# EAGLE design S-270_Malus_Main_board (EAGLE 9.5.1)
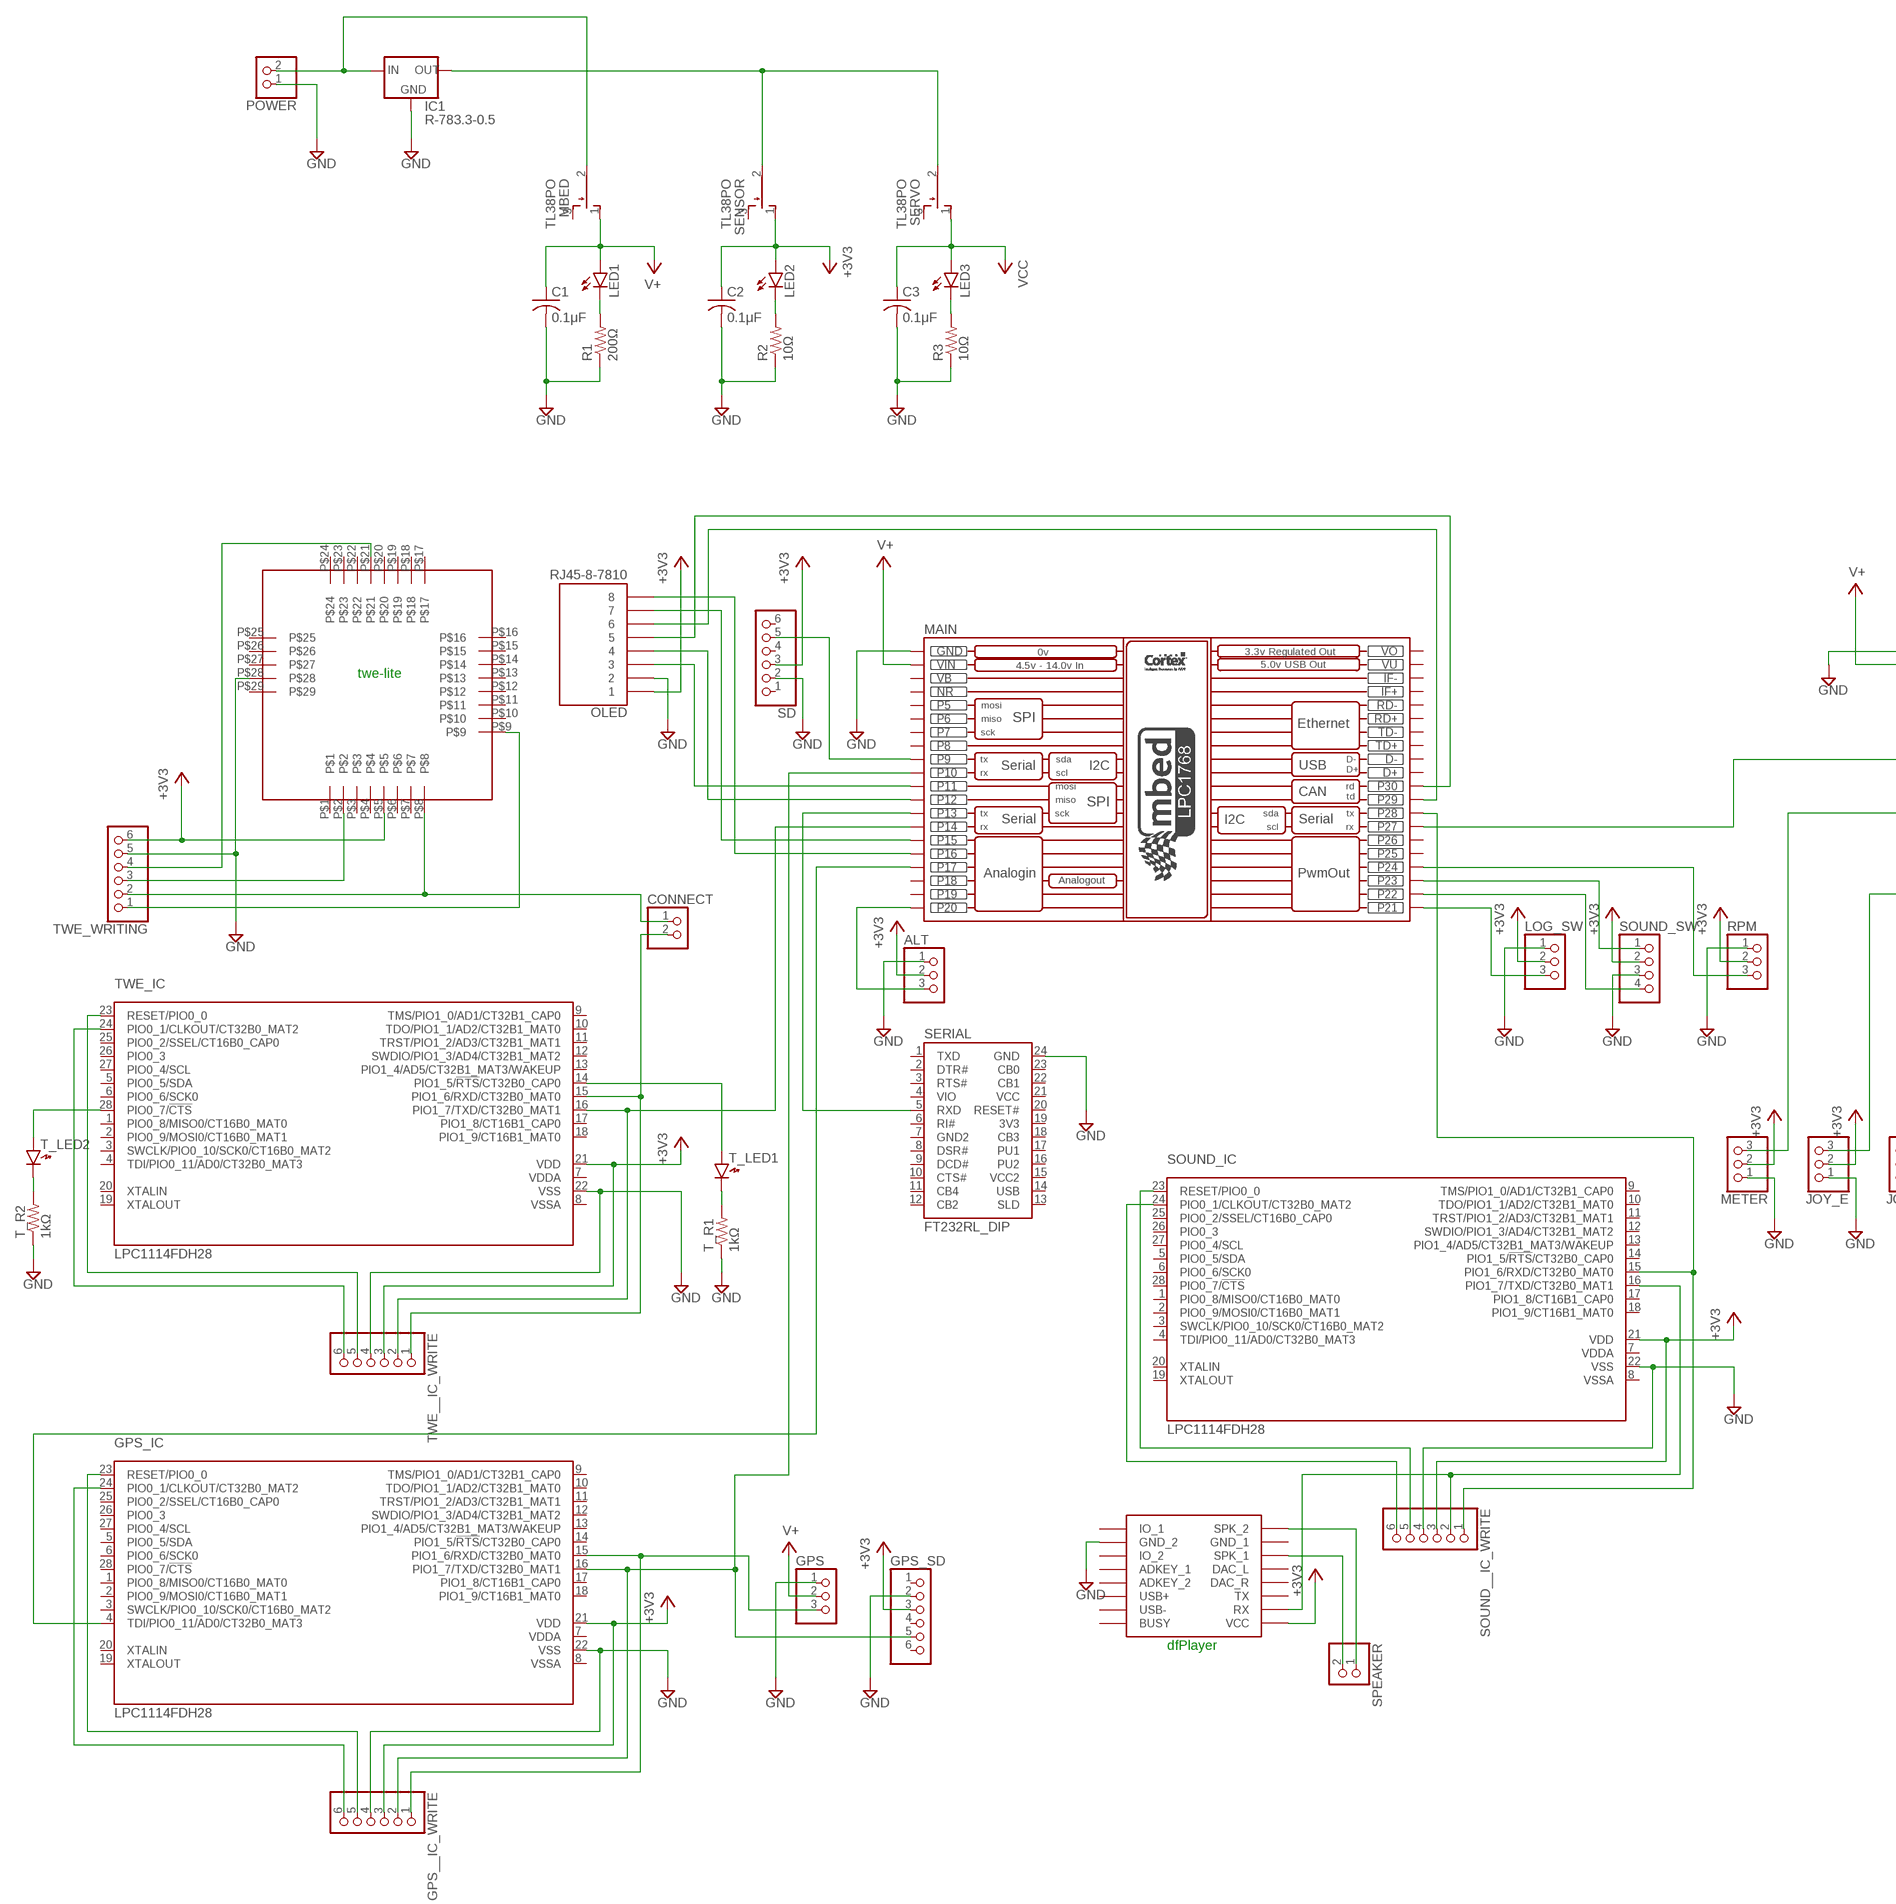
[diagram p0: schematic, sheet 1, part 1 of 2]
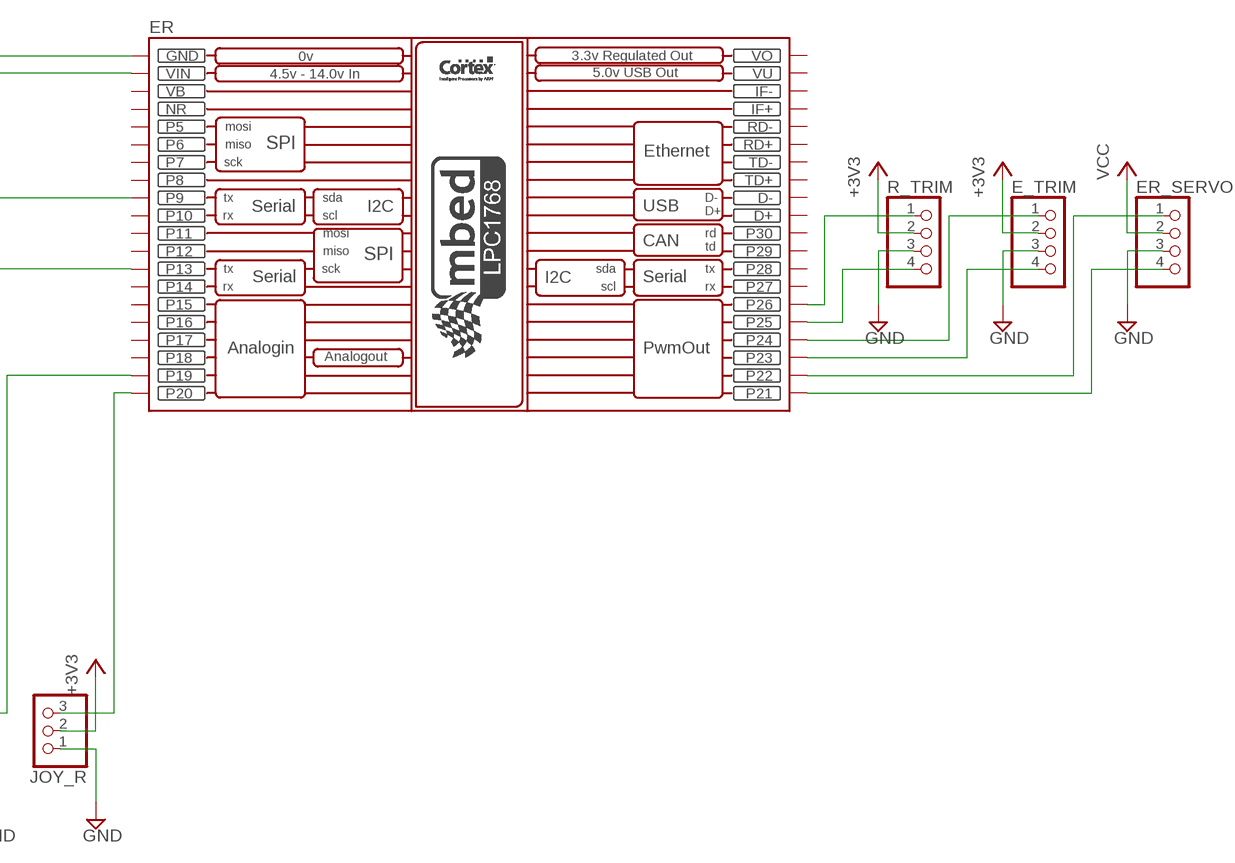
[diagram p1: schematic, sheet 1, part 2 of 2]

## Parts
ALT  PINHD-1X3  [1X03]
C1  0.1μF  C-USC0603  [C0603]
C2  0.1μF  C-USC0603  [C0603]
C3  0.1μF  C-USC0603  [C0603]
CONNECT  PINHD-1X2  [1X02]
E_TRIM  PINHD-1X4  [1X04]
ER  MBED_NXP_LPC1768  [MBED-KIT]
ER_SERVO  PINHD-1X4/90  [1X04/90]
GPS  PINHD-1X3  [1X03]
GPS__IC_WRITE  PINHD-1X6  [1X06]
GPS_IC  LPC1114FDH28  [SOT361-1]
GPS_SD  PINHD-1X6  [1X06]
IC1  R-783.3-0.5  [SIP3]
JOY_E  PINHD-1X3  [1X03]
JOY_R  PINHD-1X3  [1X03]
LED1  LED3MM  [LED3MM]
LED2  LED3MM  [LED3MM]
LED3  LED3MM  [LED3MM]
LOG_SW  PINHD-1X3  [1X03]
MAIN  MBED_NXP_LPC1768  [MBED-KIT]
MBED  TL38PO  [TL3XPO]
METER  PINHD-1X3  [1X03]
OLED  RJ45-8-7810  [RJ-45_7810-8P8C]
POWER  PINHD-1X2  [1X02]
R1  200Ω  R-US_R0603  [R0603]
R2  10Ω  R-US_R0603  [R0603]
R3  10Ω  R-US_R0603  [R0603]
R_TRIM  PINHD-1X4  [1X04]
RPM  PINHD-1X3  [1X03]
SD  PINHD-1X6  [1X06]
SENSOR  TL38PO  [TL3XPO]
SERIAL  FT232RL_DIP  [FT232RL_DIP]
SERVO  TL38PO  [TL3XPO]
SOUND__IC_WRITE  PINHD-1X6  [1X06]
SOUND_IC  LPC1114FDH28  [SOT361-1]
SOUND_SW  PINHD-1X4  [1X04]
SPEAKER  PINHD-1X2  [1X02]
T_LED1  LED1608  [LED1608]
T_LED2  LED1608  [LED1608]
T_R1  1kΩ  R-US_R0603  [R0603]
T_R2  1kΩ  R-US_R0603  [R0603]
TWE__IC_WRITE  PINHD-1X6  [1X06]
TWE_IC  LPC1114FDH28  [SOT361-1]
TWE_WRITING  PINHD-1X6  [1X06]
U$1  DFPLAYER  [DFPLAYER]
U$2  LITE  [LITE]

## Nets
+3V3: ALT.2 C2.1 E_TRIM.2 GPS__IC_WRITE.3 GPS_IC.21(VDD) GPS_SD.3 JOY_E.2 JOY_R.2 LED2.A LOG_SW.2 METER.2 OLED.1 R_TRIM.2 RPM.2 SD.3 SENSOR.1(O) SOUND__IC_WRITE.3 SOUND_IC.21(VDD) SOUND_SW.2 TWE__IC_WRITE.3 TWE_IC.21(VDD) TWE_WRITING.6 U$1.VCC U$2.P$5
GND: ALT.1 C1.2 C2.2 C3.2 E_TRIM.3 ER.GND ER_SERVO.3 GPS.1 GPS__IC_WRITE.4 GPS_IC.22(VSS) GPS_SD.2 IC1.2(GND) JOY_E.1 JOY_R.1 LOG_SW.1 MAIN.GND METER.1 OLED.2 POWER.1 R1.1 R2.1 R3.1 R_TRIM.3 RPM.1 SD.2 SERIAL.24(GND) SOUND__IC_WRITE.4 SOUND_IC.22(VSS) SOUND_SW.3 T_R1.1 T_R2.1 TWE__IC_WRITE.4 TWE_IC.22(VSS) TWE_WRITING.5 U$1.GND_2 U$2.P$28
N$1: IC1.1(IN) MBED.2(P) POWER.2
N$2: LED1.K(C) R1.2
N$3: LOG_SW.3 MAIN.P$21(P21)
N$4: LED3.K(C) R3.2
N$5: LED2.K(C) R2.2
N$6: MAIN.P$24(P24) RPM.3
N$7: MAIN.P$9(P9) SD.5
N$8: IC1.3(OUT) SENSOR.2(P) SERVO.2(P)
N$9: MAIN.P$23(P23) SOUND_SW.1
N$10: MAIN.P$11(P11) OLED.3
N$11: MAIN.P$22(P22) SOUND_SW.4
N$12: MAIN.P$12(P12) OLED.4
N$13: MAIN.P$30(P30) OLED.5
N$14: MAIN.P$29(P29) OLED.6
N$15: MAIN.P$15(P15) OLED.7
N$16: MAIN.P$16(P16) OLED.8
N$17: GPS__IC_WRITE.5 GPS_IC.23(RESET/PIO0_0)
N$18: GPS__IC_WRITE.6 GPS_IC.24(PIO0_1/CLKOUT/CT32B0_MAT2)
N$19: GPS__IC_WRITE.2 GPS_IC.16(PIO1_7/TXD/CT32B0_MAT1) GPS_SD.5 MAIN.P$10(P10)
N$20: GPS.3 GPS__IC_WRITE.1 GPS_IC.15(PIO1_6/RXD/CT32B0_MAT0)
N$21: SOUND__IC_WRITE.5 SOUND_IC.23(RESET/PIO0_0)
N$22: SOUND__IC_WRITE.6 SOUND_IC.24(PIO0_1/CLKOUT/CT32B0_MAT2)
N$23: TWE__IC_WRITE.5 TWE_IC.23(RESET/PIO0_0)
N$24: TWE__IC_WRITE.6 TWE_IC.24(PIO0_1/CLKOUT/CT32B0_MAT2)
N$25: SOUND__IC_WRITE.2 SOUND_IC.16(PIO1_7/TXD/CT32B0_MAT1) U$1.RX
N$26: MAIN.P$28(P28) SOUND__IC_WRITE.1 SOUND_IC.15(PIO1_6/RXD/CT32B0_MAT0)
N$27: MAIN.P$14(P14) TWE__IC_WRITE.2 TWE_IC.16(PIO1_7/TXD/CT32B0_MAT1)
N$28: CONNECT.2 TWE__IC_WRITE.1 TWE_IC.15(PIO1_6/RXD/CT32B0_MAT0)
N$29: T_LED1.A TWE_IC.14(PIO1_5/!RTS!/CT32B0_CAP0)
N$30: SPEAKER.2 U$1.SPK1(SPK_1)
N$31: SPEAKER.1 U$1.SPK2(SPK_2)
N$32: T_LED1.K T_R1.2
N$33: T_LED2.A TWE_IC.28(PIO0_7/!CTS!)
N$34: T_LED2.K T_R2.2
N$35: MAIN.P$13(P13) SERIAL.5(RXD)
N$36: ALT.3 MAIN.P$20(P20)
N$37: TWE_WRITING.4 U$2.P$21
N$38: TWE_WRITING.3 U$2.P$2
N$39: CONNECT.1 TWE_WRITING.2 U$2.P$8
N$40: TWE_WRITING.1 U$2.P$9
N$41: GPS_IC.4(TDI/PIO0_11/AD0/CT32B0_MAT3) MAIN.P$17(P17)
N$42: ER.P$9(P9) MAIN.P$27(P27)
N$43: ER.P$13(P13) METER.3
N$44: ER.P$19(P19) JOY_E.3
N$45: ER.P$20(P20) JOY_R.3
N$46: ER.P$26(P26) R_TRIM.1
N$47: E_TRIM.1 ER.P$24(P24)
N$48: ER.P$25(P25) R_TRIM.4
N$49: E_TRIM.4 ER.P$23(P23)
N$50: ER.P$22(P22) ER_SERVO.1
N$51: ER.P$21(P21) ER_SERVO.4
V+: C1.1 ER.VIN GPS.2 LED1.A MAIN.VIN MBED.1(O)
VCC: C3.1 ER_SERVO.2 LED3.A SERVO.1(O)
Unconnected: ER.D+ ER.D- ER.IF+ ER.IF- ER.P$5(P5) ER.P$6(P6) ER.P$7(P7) ER.P$8(P8) ER.P$10(P10) ER.P$11(P11) ER.P$12(P12) ER.P$14(P14) ER.P$15(P15) ER.P$16(P16) ER.P$17(P17) ER.P$18(P18) ER.P$27(P27) ER.P$28(P28) ER.P$29(P29) ER.P$30(P30) ER.RD+ ER.RD- ER.TD+ ER.TD- GPS_IC.1(PIO0_8/MISO0/CT16B0_MAT0) GPS_IC.2(PIO0_9/MOSI0/CT16B0_MAT1) GPS_IC.3(SWCLK/PIO0_10/SCK0/CT16B0_MAT2) GPS_IC.5(PIO0_5/SDA) GPS_IC.6(PIO0_6/SCK0) GPS_IC.9(TMS/PIO1_0/AD1/CT32B1_CAP0) GPS_IC.10(TDO/PIO1_1/AD2/CT32B1_MAT0) GPS_IC.11(TRST/PIO1_2/AD3/CT32B1_MAT1) GPS_IC.12(SWDIO/PIO1_3/AD4/CT32B1_MAT2) GPS_IC.13(PIO1_4/AD5/CT32B1_MAT3/WAKEUP) GPS_IC.14(PIO1_5/!RTS!/CT32B0_CAP0) GPS_IC.17(PIO1_8/CT16B1_CAP0) GPS_IC.18(PIO1_9/CT16B1_MAT0) GPS_IC.19(XTALOUT) GPS_IC.20(XTALIN) GPS_IC.25(PIO0_2/SSEL/CT16B0_CAP0) GPS_IC.26(PIO0_3) GPS_IC.27(PIO0_4/SCL) GPS_IC.28(PIO0_7/!CTS!) GPS_SD.1 GPS_SD.4 GPS_SD.6 MAIN.D+ MAIN.D- MAIN.IF+ MAIN.IF- MAIN.P$5(P5) MAIN.P$6(P6) MAIN.P$7(P7) MAIN.P$8(P8) MAIN.P$18(P18) MAIN.P$19(P19) MAIN.P$25(P25) MAIN.P$26(P26) MAIN.RD+ MAIN.RD- MAIN.TD+ MAIN.TD- MBED.3(S) SD.1 SD.4 SD.6 SENSOR.3(S) SERIAL.1(TXD) SERIAL.2(DTR#) SERIAL.3(RTS#) SERIAL.4(VIO) SERIAL.6(RI#) SERIAL.7(GND2) SERIAL.8(DSR#) SERIAL.9(DCD#) SERIAL.10(CTS#) SERIAL.11(CB4) SERIAL.12(CB2) SERIAL.13(SLD) SERIAL.14(USB) SERIAL.15(VCC2) SERIAL.16(PU2) SERIAL.17(PU1) SERIAL.18(CB3) SERIAL.19(3V3) SERIAL.20(RESET#) SERIAL.21(VCC) SERIAL.22(CB1) SERIAL.23(CB0) SERVO.3(S) SOUND_IC.1(PIO0_8/MISO0/CT16B0_MAT0) SOUND_IC.2(PIO0_9/MOSI0/CT16B0_MAT1) SOUND_IC.3(SWCLK/PIO0_10/SCK0/CT16B0_MAT2) SOUND_IC.4(TDI/PIO0_11/AD0/CT32B0_MAT3) SOUND_IC.5(PIO0_5/SDA) SOUND_IC.6(PIO0_6/SCK0) SOUND_IC.9(TMS/PIO1_0/AD1/CT32B1_CAP0) SOUND_IC.10(TDO/PIO1_1/AD2/CT32B1_MAT0) SOUND_IC.11(TRST/PIO1_2/AD3/CT32B1_MAT1) SOUND_IC.12(SWDIO/PIO1_3/AD4/CT32B1_MAT2) SOUND_IC.13(PIO1_4/AD5/CT32B1_MAT3/WAKEUP) SOUND_IC.14(PIO1_5/!RTS!/CT32B0_CAP0) SOUND_IC.17(PIO1_8/CT16B1_CAP0) SOUND_IC.18(PIO1_9/CT16B1_MAT0) SOUND_IC.19(XTALOUT) SOUND_IC.20(XTALIN) SOUND_IC.25(PIO0_2/SSEL/CT16B0_CAP0) SOUND_IC.26(PIO0_3) SOUND_IC.27(PIO0_4/SCL) SOUND_IC.28(PIO0_7/!CTS!) TWE_IC.1(PIO0_8/MISO0/CT16B0_MAT0) TWE_IC.2(PIO0_9/MOSI0/CT16B0_MAT1) TWE_IC.3(SWCLK/PIO0_10/SCK0/CT16B0_MAT2) TWE_IC.4(TDI/PIO0_11/AD0/CT32B0_MAT3) TWE_IC.5(PIO0_5/SDA) TWE_IC.6(PIO0_6/SCK0) TWE_IC.9(TMS/PIO1_0/AD1/CT32B1_CAP0) TWE_IC.10(TDO/PIO1_1/AD2/CT32B1_MAT0) TWE_IC.11(TRST/PIO1_2/AD3/CT32B1_MAT1) TWE_IC.12(SWDIO/PIO1_3/AD4/CT32B1_MAT2) TWE_IC.13(PIO1_4/AD5/CT32B1_MAT3/WAKEUP) TWE_IC.17(PIO1_8/CT16B1_CAP0) TWE_IC.18(PIO1_9/CT16B1_MAT0) TWE_IC.19(XTALOUT) TWE_IC.20(XTALIN) TWE_IC.25(PIO0_2/SSEL/CT16B0_CAP0) TWE_IC.26(PIO0_3) TWE_IC.27(PIO0_4/SCL) U$1.ADKEY1(ADKEY_1) U$1.ADKEY2(ADKEY_2) U$1.BUSY U$1.DAC_L U$1.DAC_R U$1.GND_1 U$1.IO1(IO_1) U$1.IO2(IO_2) U$1.TX U$1.USB+ U$1.USB- U$2.P$1 U$2.P$3 U$2.P$4 U$2.P$6 U$2.P$7 U$2.P$10 U$2.P$11 U$2.P$12 U$2.P$13 U$2.P$14 U$2.P$15 U$2.P$16 U$2.P$17 U$2.P$18 U$2.P$19 U$2.P$20 U$2.P$22 U$2.P$23 U$2.P$24 U$2.P$25 U$2.P$26 U$2.P$27 U$2.P$29

## Notes on the sheet
- twe-lite
- dfPlayer

## Power pins joined to a net without a drawn wire
NR: ER.NR MAIN.NR
VB: ER.VB MAIN.VB
VDDA: GPS_IC.7(VDDA) SOUND_IC.7(VDDA) TWE_IC.7(VDDA)
VO: ER.VOUT(VO) MAIN.VOUT(VO)
VSSA: GPS_IC.8(VSSA) SOUND_IC.8(VSSA) TWE_IC.8(VSSA)
VU: ER.VU MAIN.VU

## Library data of the parts
ALT GPS JOY_E JOY_R LOG_SW METER RPM = pinhead:PINHD-1X3: PIN HEADER
C1-C3 = rcl:C-US: CAPACITOR, American symbol; SPICEPREFIX: C
CONNECT POWER SPEAKER = pinhead:PINHD-1X2: PIN HEADER
E_TRIM ER_SERVO R_TRIM SOUND_SW = pinhead:PINHD-1X4: PIN HEADER
ER MAIN = lpc1768:MBED_NXP_LPC1768: Mbed LPC1768 - ARM CORTEX v2.1 * Schematic symbol is now placed in eagles's default raster. *The pads diameter are suitable for routing between mbed pins * mbed pads are 0.8 mm drill diameter. --------------------------------------------- Created by: Mohamed Yousry *Alexandria, Egypt *Email: mohamed.yousry@ieeegoldegypt.org
GPS__IC_WRITE GPS_SD SD SOUND__IC_WRITE TWE__IC_WRITE TWE_WRITING = pinhead:PINHD-1X6: PIN HEADER
GPS_IC SOUND_IC TWE_IC = nxp_60:LPC1114FDH28: LPC1114 50 MHz 32-bit ARM Cortex-M0 based microcontroller featuring a high level of integration and very low power consumption. On-chip flash program memory The LPC1110/11/12/13/14 contain 32 kB (LPC1114), 24 kB (LPC1113), 16 kB (LPC1112), 8 kB (LPC1111),or 4 kB (LPC1110) of on-chip flash memory. On-chip SRAM The LPC1110/11/12/13/14 contain a total of 8 kB, 4 kB, 2 kB, or 1 kB on-chip static RAM memory. MK - Datasheet available on www.nxp.com
IC1 = r-78xx_10:R-78*-0.5: Innoline R-78xx-0.5 Series Switching Regulators - 0.5A, Standard Source: http://www.recom-international.com/pdf/Innoline/R-78xx-0.5.pdf; MF: Recom; MPN: R-783.3-05; OC_FARNELL: 1793140; OC_NEWARK: 62X9539
LED1-LED3 = led:LED: LED OSRAM: - CHIPLED LG R971, LG N971, LY N971, LG Q971, LY Q971, LO R971, LY R971 LH N974, LH R974 LS Q976, LO Q976, LY Q976 LO Q996 - Hyper CHIPLED LW Q18S LB Q993, LB Q99A, LB R99A - SideLED LS A670, LO A670, LY A670, LG A670, LP A670 LB A673, LV A673, LT A673, LW A673 LH A674 LY A675 LS A676, LA A676, LO A676, LY A676, LW A676 LS A679, LY A679, LG A679 - Hyper Micro SIDELED® LS Y876, LA Y876, LO Y876, LY Y876 LT Y87S - SmartLED LW L88C, LW L88S LB L89C, LB L89S, LG L890 LS L89K, LO L89K, LY L89K LS L896, LA L896, LO L896, LY L896 - TOPLED LS T670, LO T670, LY T670, LG T670, LP T670 LSG T670, LSP T670, LSY T670, LOP T670, LYG T670 LG T671, LOG T671, LSG T671 LB T673, LV T673, LT T673, LW T673 LH T674 LS T676, LA T676, LO T676, LY T676, LB T676, LH T676, LSB T676, LW T676 LB T67C, LV T67C, LT T67C, LS T67K, LO T67K, LY T67K, LW E67C LS E67B, LA E67B, LO E67B, LY E67B, LB E67C, LV E67C, LT E67C LW T67C LS T679, LY T679, LG T679 LS T770, LO T770, LY T770, LG T770, LP T770 LB T773, LV T773, LT T773, LW T773 LH T774 LS E675, LA E675, LY E675, LS T675 LS T776, LA T776, LO T776, LY T776, LB T776 LHGB T686 LT T68C, LB T68C - Hyper Mini TOPLED® LB M676 - Mini TOPLED Santana® LG M470 LS M47K, LO M47K, LY M47K Source: http://www.osram.convergy.de LUXEON: - LUMILED® LXK2-PW12-R00, LXK2-PW12-S00, LXK2-PW14-U00, LXK2-PW14-V00 LXK2-PM12-R00, LXK2-PM12-S00, LXK2-PM14-U00 LXK2-PE12-Q00, LXK2-PE12-R00, LXK2-PE12-S00, LXK2-PE14-T00, LXK2-PE14-U00 LXK2-PB12-K00, LXK2-PB12-L00, LXK2-PB12-M00, LXK2-PB14-N00, LXK2-PB14-P00, LXK2-PB14-Q00 LXK2-PR12-L00, LXK2-PR12-M00, LXK2-PR14-Q00, LXK2-PR14-R00 LXK2-PD12-Q00, LXK2-PD12-R00, LXK2-PD12-S00 LXK2-PH12-R00, LXK2-PH12-S00 LXK2-PL12-P00, LXK2-PL12-Q00, LXK2-PL12-R00 Source: www.luxeon.com KINGBRIGHT: KA-3528ASYC Source: www.kingbright.com
MBED SENSOR SERVO = switch:TL38PO: TINY SWITCH ON OFF MOM Source: http://www2.produktinfo.conrad.com/datenblaetter/700000-724999/705152-da-01-de-Subminiaturschalter_TL_36YO.pdf
OLED = Connector-etc:RJ45-8: RJ45 Jack Simple RJ45, 8-pin connection - connector for common Cat5, Cat5e, and Cat6 Ethernet cables. Footprint not yet proven in production. Connector sku is PRT-00643; Breakout PCB sku is BOB-00716.
R1-R3 T_R1 T_R2 = rcl:R-US_: RESISTOR, American symbol; SPICEPREFIX: R
SERIAL = ft232rl_dip:FT232RL_DIP
T_LED1 T_LED2 = generic:LED: Generic LEDs
U$1 = DFPlayer_Mini:DFPLAYER
U$2 = twelite:LITE

## Board
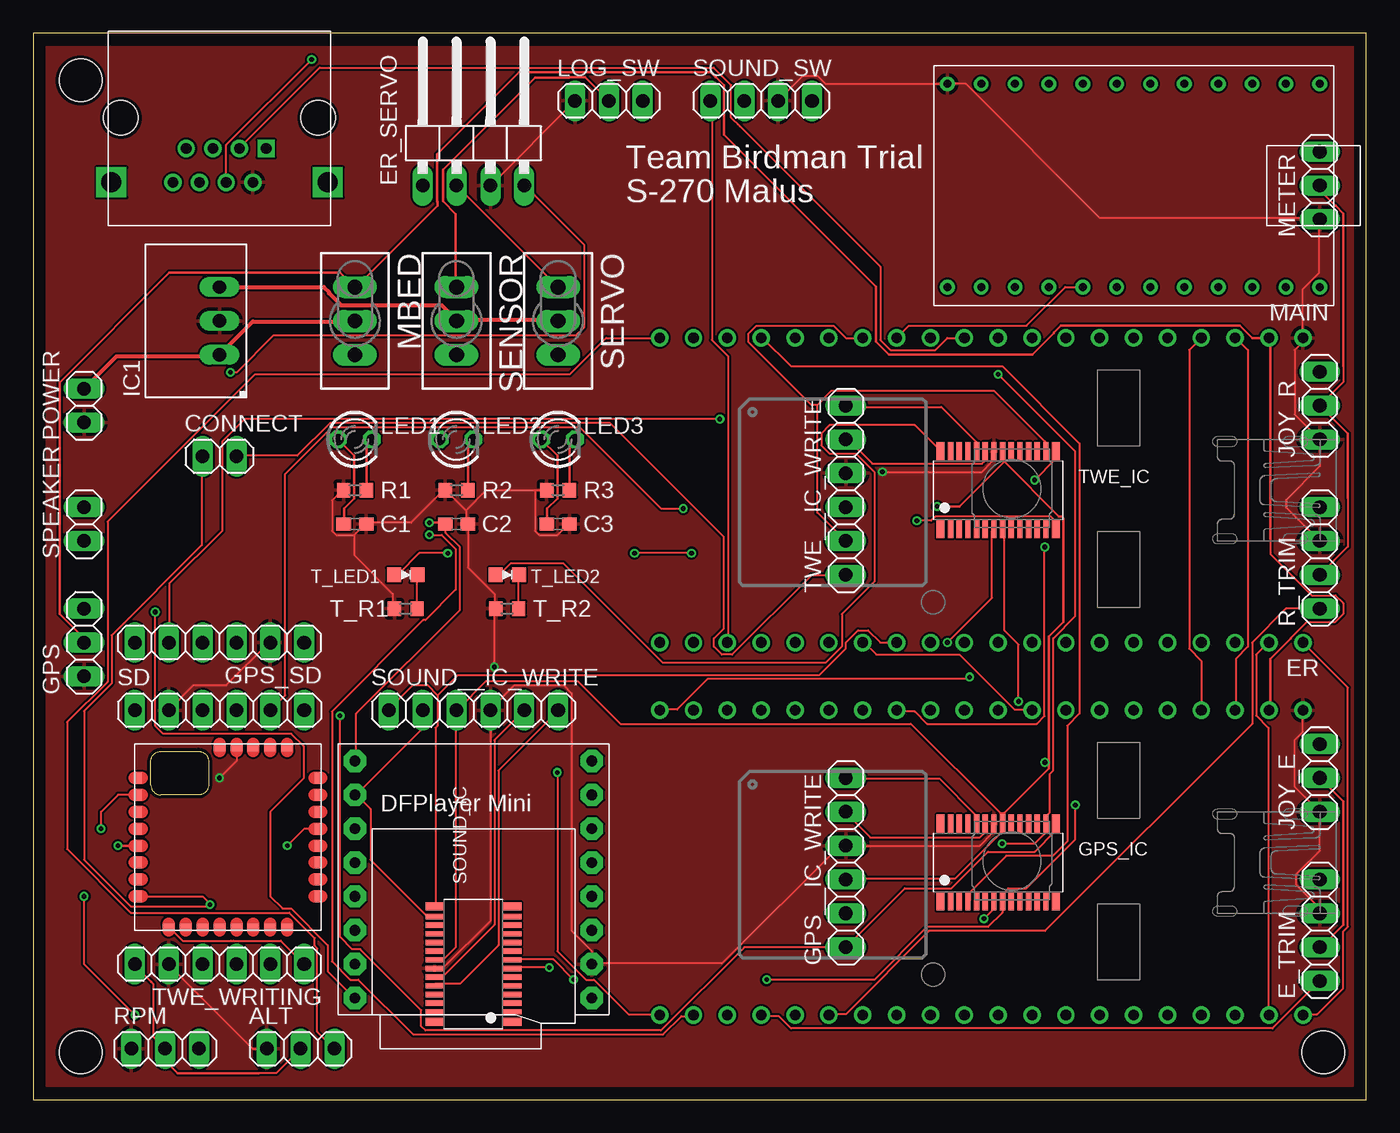
[diagram p2: board, top side]
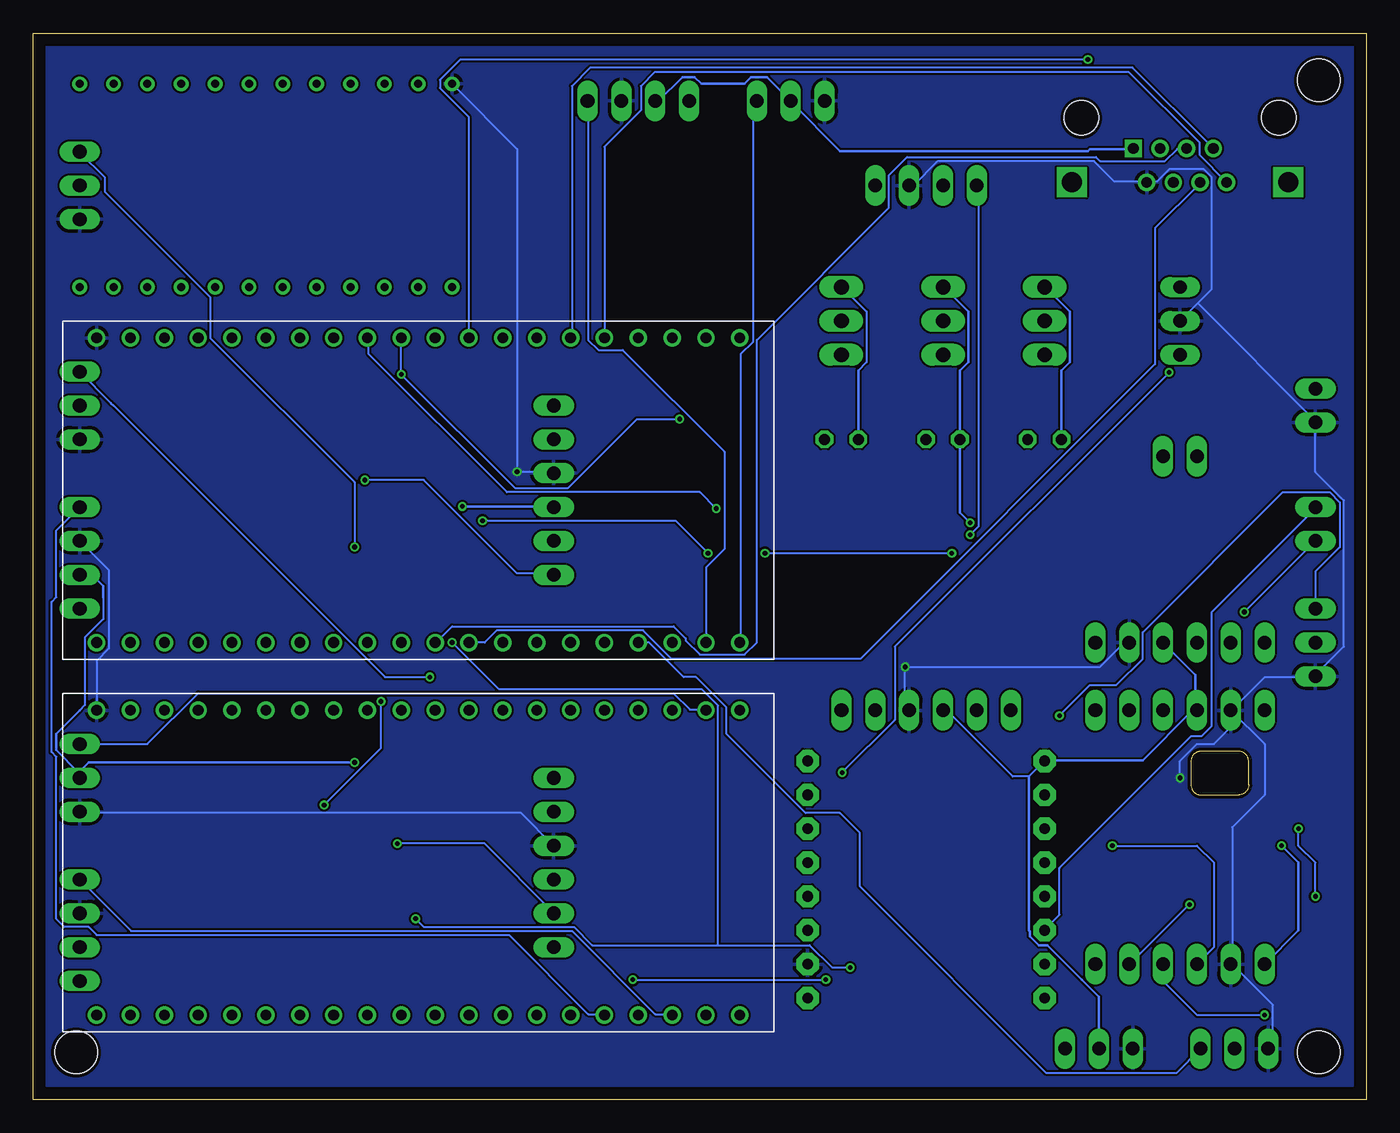
[diagram p3: board, bottom side, seen from below]

Size 100 x 80 mm. Coordinates in mm from the lower left corner, seen from the top.
Outline: 0,0 100,0 100,80 0,80 0,0
Copper layers (1*16): Top 0.035mm / dielectric 1.5mm / Bottom 0.035mm
Design rules "SeeedStudio_2layer_DRU_no_angle_20140221": minimum track width 6mil, minimum drill 12mil, track to track 6mil, track to pad 6mil, pad to pad 6mil, via to via 6mil, smd to smd 0mil, copper to edge 10mil, drill to drill 10mil, minimum pad ring 10mil, minimum via ring 6mil, stop-mask expansion 2mil, vias tented up to drill 100mil, thermal gap 10mil
Holes 3.2 mm at 3.54,76.47 3.54,3.54 96.79,3.54

### Footprints (pad centres in the part's own frame; a part is rotated, then mirrored left to right if it is on the bottom)
1X03 = drill 1.016 long: 1 -2.54,0; 2 0,0; 3 2.54,0
C0603 = smd 1.1 x 1: 1 -0.85,0; 2 0.85,0
1X02 = drill 1.016 long: 1 -1.27,0; 2 1.27,0
1X04 = drill 1.016 long: 1 -3.81,0; 2 -1.27,0; 3 1.27,0; 4 3.81,0
MBED-KIT = drill 0.8: D+ 11.43,1.27; D- 11.43,3.81; GND -11.43,24.13; IF+ 11.43,16.51; IF- 11.43,19.05; NR -11.43,16.51; P$5 -11.43,13.97; P$6 -11.43,11.43; P$7 -11.43,8.89; P$8 -11.43,6.35; P$9 -11.43,3.81; P$10 -11.43,1.27; P$11 -11.43,-1.27; P$12 -11.43,-3.81; P$13 -11.43,-6.35; P$14 -11.43,-8.89; P$15 -11.43,-11.43; P$16 -11.43,-13.97; P$17 -11.43,-16.51; P$18 -11.43,-19.05; P$19 -11.43,-21.59; P$20 -11.43,-24.13; P$21 11.43,-24.13; P$22 11.43,-21.59; P$23 11.43,-19.05; P$24 11.43,-16.51; P$25 11.43,-13.97; P$26 11.43,-11.43; P$27 11.43,-8.89; P$28 11.43,-6.35; P$29 11.43,-3.81; P$30 11.43,-1.27; RD+ 11.43,11.43; RD- 11.43,13.97; TD+ 11.43,6.35; TD- 11.43,8.89; VB -11.43,19.05; VIN -11.43,21.59; VOUT 11.43,24.13; VU 11.43,21.59
1X04/90 = drill 1.016 long: 1 -3.81,-3.81; 2 -1.27,-3.81; 3 1.27,-3.81; 4 3.81,-3.81
1X06 = drill 1.016 long: 1 -6.35,0; 2 -3.81,0; 3 -1.27,0; 4 1.27,0; 5 3.81,0; 6 6.35,0
SOT361-1 = smd 0.6 x 1.35: 1 -4.325,-2.925; 14 4.325,-2.925; 15 4.325,2.925; 28 -4.325,2.925 | smd 0.4 x 1.35: 2 -3.575,-2.925; 3 -2.925,-2.925; 4 -2.275,-2.925; 5 -1.625,-2.925; 6 -0.975,-2.925; 7 -0.325,-2.925; 8 0.325,-2.925; 9 0.975,-2.925; 10 1.625,-2.925; 11 2.275,-2.925; 12 2.925,-2.925; 13 3.575,-2.925; 16 3.575,2.925; 17 2.925,2.925; 18 2.275,2.925; 19 1.625,2.925; 20 0.975,2.925; 21 0.325,2.925; 22 -0.325,2.925; 23 -0.975,2.925; 24 -1.625,2.925; 25 -2.275,2.925; 26 -2.925,2.925; 27 -3.575,2.925
SIP3 = drill 1 long: 1 -2.54,0; 2 0,0; 3 2.54,0
LED3MM = drill 0.813 octagon: A -1.27,0; K 1.27,0
TL3XPO = drill 1.1 pad 1.422 long: 1 -2.54,0; 2 0,0; 3 2.54,0
RJ-45_7810-8P8C = drill 0.8 square: 1 -3.5,2.3 | drill 0.8: 2 -2.5,4.84; 3 -1.5,2.3; 4 -0.5,4.84; 5 0.5,2.3; 6 1.5,4.84; 7 2.5,2.3; 8 3.5,4.84 | drill 1.5 square: P$1 -8.125,4.84; P$2 8.125,4.84 | hole 2.6: -7.4,0; 7.4,0
R0603 = smd 1 x 1.1: 1 -0.85,0; 2 0.85,0
FT232RL_DIP = drill 0.6: 1 -7.62,13.97; 2 -7.62,11.43; 3 -7.62,8.89; 4 -7.62,6.35; 5 -7.62,3.81; 6 -7.62,1.27; 7 -7.62,-1.27; 8 -7.62,-3.81; 9 -7.62,-6.35; 10 -7.62,-8.89; 11 -7.62,-11.43; 12 -7.62,-13.97; 13 7.62,-13.97; 14 7.62,-11.43; 15 7.62,-8.89; 16 7.62,-6.35; 17 7.62,-3.81; 18 7.62,-1.27; 19 7.62,1.27; 20 7.62,3.81; 21 7.62,6.35; 22 7.62,8.89; 23 7.62,11.43; 24 7.62,13.97
LED1608 = smd 1.05 x 1.08: A -0.875,0; K 0.875,0
DFPLAYER = drill 0.8 pad 1.676 octagon: ADKEY1 8.89,-1.27; ADKEY2 8.89,1.27; BUSY 8.89,8.89; DAC_L -8.89,-1.27; DAC_R -8.89,1.27; GND_1 -8.89,-6.35; GND_2 8.89,-6.35; IO1 8.89,-8.89; IO2 8.89,-3.81; RX -8.89,6.35; SPK1 -8.89,-3.81; SPK2 -8.89,-8.89; TX -8.89,3.81; USB+ 8.89,3.81; USB- 8.89,6.35; VCC -8.89,8.89
LITE = smd 0.5 x 0.9: P$1 0.25,11.43; P$2 0.25,10.16; P$3 0.25,8.89; P$4 0.25,7.62; P$5 0.25,6.35; P$6 0.25,5.08; P$7 0.25,3.81; P$8 0.25,2.54; P$17 13.72,2.54; P$18 13.72,3.81; P$19 13.72,5.08; P$20 13.72,6.35; P$21 13.72,7.62; P$22 13.72,8.89; P$23 13.72,10.16; P$24 13.72,11.43 | smd 0.9 x 0.5: P$9 2.54,0.25; P$10 3.81,0.25; P$11 5.08,0.25; P$12 6.35,0.25; P$13 7.62,0.25; P$14 8.89,0.25; P$15 10.16,0.25; P$16 11.43,0.25; P$25 11.43,13.72; P$26 10.16,13.72; P$27 8.89,13.72; P$28 7.62,13.72; P$29 6.35,13.72

### Placement (x,y rotation side)
ALT  20.05,3.81 0 top
C1  24.13,43.18 0 top
C2  31.75,43.18 0 top
C3  39.37,43.18 0 top
CONNECT  13.97,48.26 0 top
E_TRIM  96.52,12.7 90 top
ER  71.12,17.78 270 top
ER_SERVO  33.02,72.39 0 top
GPS  3.81,34.29 90 top
GPS__IC_WRITE  60.96,17.78 90 top
GPS_IC  72.39,17.78 0 top
GPS_SD  13.97,34.29 180 top
IC1  13.97,58.42 90 top
JOY_E  96.52,24.13 90 top
JOY_R  96.52,52.07 90 top
LED1  24.13,49.53 0 top
LED2  31.75,49.53 0 top
LED3  39.37,49.53 0 top
LOG_SW  43.18,74.93 0 top
MAIN  71.12,45.72 270 top
MBED  24.13,58.42 270 top
METER  96.52,68.58 90 top
OLED  13.97,73.66 180 top
POWER  3.81,52.07 90 top
R1  24.13,45.72 0 top
R2  31.75,45.72 0 top
R3  39.37,45.72 0 top
R_TRIM  96.52,40.64 90 top
RPM  9.89,3.81 0 top
SD  13.97,29.21 0 top
SENSOR  31.75,58.42 270 top
SERIAL  82.55,68.58 90 top
SERVO  39.37,58.42 270 top
SOUND__IC_WRITE  33.02,29.21 0 top
SOUND_IC  33.02,10.16 90 top
SOUND_SW  54.61,74.93 0 top
SPEAKER  3.81,43.18 90 top
T_LED1  27.94,39.37 0 top
T_LED2  35.56,39.37 0 top
T_R1  27.94,36.83 0 top
T_R2  35.56,36.83 0 top
TWE__IC_WRITE  60.96,45.72 90 top
TWE_IC  72.39,45.72 0 top
TWE_WRITING  13.97,10.16 180 top
U$1  33.02,16.51 0 top
U$2  7.62,12.7 0 top

### Tracks (layer width: path | path; a pad name or v marks a point on that pad's centre or on a via)
+3V3  (via drill 0.35)
  Top 0.152: GPS__IC_WRITE.3 60.96,16.61 69.19,16.61 72.69,20.12 72.69,20.57 GPS_IC.21 72.85,20.73 | 72.85,48.62 TWE_IC.21 | SOUND_IC.21 30.18,10.52 30.79,10.52 31.7,11.43 31.7,29.11 SOUND__IC_WRITE.3 31.85,29.26 33.98,31.39 40.84,31.39 44.04,28.19 65.84,28.19 72.54,21.49 72.85,21.49 | 24.23,25.45 24.23,28.96 32,36.73 32,41.45 30.94,42.52 30.94,43.13 C2.1 30.79,43.28 | 98.3,55.02 98.3,53.85 JOY_R.2 | 98.63,45.13 98.63,41.48 R_TRIM.2 | 8.84,8.84 9,8.68 9,4.7 RPM.2 | ALT.2 18.22,1.98 16.92,1.98
  Top 0.2: 72.85,47.85 72.85,48.62 | 72.85,47.85 76.96,43.74 77.11,43.74 77.27,43.59 77.27,35.81 76.2,34.75 76.2,25.3 | 76.2,25.3 76.2,24.84 72.85,21.49 72.85,20.73 | v67.82,44.5 69.49,44.5 72.85,47.85 | v75.89,25.3 76.2,25.3 | 8.84,8.84 7.62,10.06 TWE_WRITING.6 | 16.92,1.98 10.82,1.98 9.89,2.91 RPM.2 | 24.23,25.45 U$1.VCC | 30.79,43.28 v29.72,43.28 | U$2.P$5 v6.35,19.05 | SENSOR.1 31.7,61.01 31.7,66.43 30.74,67.4 30.74,69.76 37.64,76.66 40.18,76.66 40.22,76.71 41.4,76.71 LOG_SW.2 | METER.2 96.62,68.48 96.62,68.12 97.69,67.05 97.7,67.05 98.3,66.46 98.3,55.02 | JOY_E.2 98.3,22.35 98.3,13.11 96.62,11.43 E_TRIM.2 | 98.63,45.13 98.63,49.96 JOY_R.2
  Bottom 0.152: 60.96,44.5 TWE__IC_WRITE.3 | SENSOR.1 31.7,60.96 | 24.08,25.45 U$1.VCC | 25.3,24.23 26.52,24.23 31.39,29.11 31.7,29.11 SOUND__IC_WRITE.3 | 94.74,37.68 94.74,36.05 96.13,34.66 96.13,29.6 96.52,29.21
  Bottom 0.2: v67.82,44.5 60.96,44.5 | 96.62,24.54 98.3,26.21 98.3,27.43 96.52,29.21 | v75.89,25.3 95.86,25.3 96.62,24.54 | OLED.1 17.53,71.32 20.73,71.32 20.88,71.17 39.47,71.17 43.13,74.83 LOG_SW.2 44.96,76.71 46.14,76.71 46.65,76.2 49.87,76.2 50.38,76.71 51.31,76.71 53.09,74.93 SOUND_SW.2 | GPS_SD.3 12.8,31.85 12.8,29.26 SD.3 12.8,29.11 13.11,29.11 16.76,25.45 24.08,25.45 | ALT.2 20.05,7.69 21.33,8.98 21.33,8.99 23.93,11.58 24.55,11.58 25.22,12.25 25.22,12.62 25.3,12.7 25.3,24.23 U$1.VCC | v29.72,43.28 30.48,44.04 LED2.A 30.48,54.71 29.85,55.34 29.85,59.11 31.7,60.96 | v6.35,19.05 5.08,17.78 5.08,12.7 TWE_WRITING.6 | 94.74,37.68 94.74,38.52 95.59,39.37 R_TRIM.2 | JOY_E.2 96.52,24.43 96.62,24.54
GND  (via drill 0.35)
  Top 0.152: v63.7,47.09 71.17,47.09 71.93,47.85 71.93,48.62 TWE_IC.22 | SOUND_SW.3 57.76,76.81 58.83,76.81 59.44,76.2 SERIAL.24 69.95,76.2 80.01,66.14 96.47,66.14 METER.1 96.47,65.99 96.47,62.03 95.25,60.81 MAIN.GND 95.25,56.84 94.64,56.24 94.64,51.41 JOY_R.1 96.52,47.52 94,45 | ER.GND 95.25,27.58 94.64,26.98 94.64,23.47 JOY_E.1 96.52,18.67 94.77,16.92 94.77,16.1 96.52,14.35 E_TRIM.3 | LOG_SW.1 ER_SERVO.3 | ALT.1 16.46,3.81 10.21,10.06 TWE_WRITING.5 | SD.2 12.04,31.09 14.48,31.09 17.68,34.29 GPS_SD.2 | GPS_IC.22 71.93,20.57 71.93,19.96 71.02,19.05 GPS__IC_WRITE.4 60.5,19.05 51.66,10.21 41.91,10.21 | 24.08,42.37 24.84,43.13 C1.2 24.99,43.28 28.35,43.28 30.79,45.72 R2.1 30.94,45.72 32.46,44.2 | 24.08,42.37 22.71,42.37 22.4,42.67 22.4,44.96 23.16,45.72 R1.1 | 24.08,42.37 24.08,40.84 26.98,37.95 26.98,36.88 T_R1.1 | 32.46,44.2 32.46,43.28 C2.2 32.61,43.13 32.61,39.93 34.59,37.95 34.59,36.88 T_R2.1 34.59,36.73 v34.59,32.46 | 37.64,45.72 33.98,45.72 32.46,44.2 | 37.64,45.72 R3.1 | 37.64,45.72 37.64,42.67 37.95,42.37 39.32,42.37 40.08,43.13 C3.2 | SOUND_IC.22 30.18,9.91 30.79,9.91 34.29,13.41 SOUND__IC_WRITE.4 34.29,29.26 36.12,31.09 39.78,31.09 40.39,30.48 40.39,12.65 41.91,11.12 41.91,10.21 | 41.91,10.21 U$1.GND_2 | U$2.P$28 15.24,25.4 v13.97,24.13
  Top 0.2: 94,45 94,44.43 R_TRIM.3
  Bottom 0.152: TWE__IC_WRITE.4 60.96,47.09 v63.7,47.09 63.7,71.32 SERIAL.24 | ER.GND 95.25,32.92 94.34,33.83 94.34,39.73 R_TRIM.3 | IC1.2 12.65,59.74 | 12.65,59.74 11.58,60.81 11.58,69.19 12.19,69.8 14.78,69.8 15.7,68.89 16.46,68.89 OLED.2 16.61,68.89 18.9,68.89 20.42,70.41 32.16,70.41 33.98,68.58 ER_SERVO.3 | 12.65,59.74 3.81,50.9 POWER.1 3.81,47.09 1.68,44.96 1.68,33.98 3.81,31.85 GPS.1 3.81,31.7 7.62,31.7 10.06,29.26 SD.2 | SD.2 7.62,26.67 7.62,22.86 10.06,20.42 10.06,10.21 10.1,10.19 | 10.1,10.19 TWE_WRITING.5 | SOUND__IC_WRITE.4 34.29,29.26 34.59,29.57 v34.59,32.46 19.96,32.46 18.14,34.29 GPS_SD.2 | GPS__IC_WRITE.4 63.4,21.49 96.47,21.49 JOY_E.1 | v13.97,24.13 13.97,25.4 12.7,26.67 11.43,26.67 10.16,27.94 SD.2 | RPM.1 7,4.16 7,7.1 10.1,10.19
  pour Top: 1,79 99,79 99,1 1,1
  pour Bottom: 1,79 1,1 99,1 99,79
N$1
  Top 0.2: 13.87,55.78 IC1.1
  Top 0.305: 13.87,55.78 6.25,55.78 POWER.2 | IC1.1 16.46,58.37 24.08,58.37 MBED.2
N$2
  Top 0.152: 24.99,45.72 R1.2
  Top 0.2: 24.99,45.72 24.99,49.23 25.3,49.53 LED1.K
N$3
  Bottom 0.152: MAIN.P$21 46.94,34.29 46.94,55.93 46.02,56.84 46.02,74.52 45.72,74.83 LOG_SW.3
N$4
  Top 0.152: 40.23,45.72 R3.2
  Top 0.2: 40.23,45.72 40.23,49.23 40.54,49.53 LED3.K
N$5
  Top 0.152: 32.61,45.72 R2.2
  Top 0.2: 32.61,45.72 32.61,49.23 32.92,49.53 LED2.K
N$6
  Bottom 0.152: MAIN.P$24 53.8,34.29 51.21,31.7 50.29,31.7 48.01,29.41 48.01,27.43 42.06,21.49 39.49,21.49 38,20 38,16 23.98,1.98 14.26,1.98 RPM.3
N$7  (via drill 0.35)
  Top 0.152: v48.77,44.35 47.09,44.35 41,50.44 22.4,50.44 18.9,46.94 18.9,30.33 SD.5
  Bottom 0.152: v48.77,44.35 49.99,45.57 64.47,45.57 74.83,55.93 74.83,57.15 MAIN.P$9
N$8
  Top 0.305: IC1.3 21.79,60.96 22.18,60.58 22.18,60.49 23.08,59.59 30.63,59.59 31.7,58.52 SENSOR.2 31.85,58.52 39.32,58.52 SERVO.2
N$9
  Top 0.152: MAIN.P$23 52.12,34.29 52.12,55.78 50.9,57 50.9,74.83 SOUND_SW.1
N$10
  Top 0.152: MAIN.P$11 68.58,57.15 67.67,56.24 64.31,56.24 63.55,57 63.55,62.48 53.02,73.02 | 52.86,73.18 53.02,73.02 | 51.04,77.42 21.49,77.42 15.54,71.48 OLED.3 | 51.04,77.42 51.05,77.42 | 51.04,77.42 52.35,76.11 52.35,73.69 53.02,73.02
N$11
  Bottom 0.152: MAIN.P$22 49.53,39.93 48.16,41.3 48.16,48.62 55.78,56.24 57.61,56.24 58.37,57 58.37,74.83 SOUND_SW.4
N$12  (via drill 0.35)
  Top 0.152: v20.88,78.03 14.48,71.63 14.48,68.89 OLED.4
  Bottom 0.152: v20.88,78.03 67.97,78.03 69.49,76.5 69.49,75.89 67.36,73.76 67.36,57.15 MAIN.P$12
N$13
  Bottom 0.152: OLED.5 13.56,71.32 14.17,71.32 15.09,70.41 19.96,70.41 20.27,70.71 34.44,70.71 35.81,69.34 35.81,66.9 45.72,57 45.72,34.29 46.63,33.38 49.99,33.38 51.05,34.44 51.05,34.59 51.97,35.51 68.58,35.51 69.8,34.29 MAIN.P$30
N$14
  Bottom 0.152: MAIN.P$29 66.14,34.29 65.23,35.2 54.25,35.2 52.12,33.07 37.95,33.07 15.85,55.17 15.85,65.38 12.5,68.73 OLED.6
N$15
  Bottom 0.152: MAIN.P$15 59.59,57.15 59.59,76.05 58.22,77.42 17.53,77.42 11.58,71.48 OLED.7
N$16
  Bottom 0.152: MAIN.P$16 57.15,71.48 54.41,74.22 54.41,76.05 53.34,77.11 17.83,77.11 12.5,71.78 12.5,70.87 10.52,68.89 OLED.8
N$17
  Top 0.152: GPS_IC.23 71.32,20.57 71.32,19.96 71.02,19.66 62.79,19.66 60.96,21.49 GPS__IC_WRITE.5
N$18
  Top 0.152: GPS_IC.24 70.71,20.73 70.71,21.34 67.97,24.08 60.96,24.08 GPS__IC_WRITE.6
N$19  (via drill 0.35)
  Top 0.152: v72.69,19.2 75.13,19.2 75.89,19.96 75.89,20.57 GPS_IC.16 76.05,20.73 76.05,21.34 76.25,21.54 76.25,24.43 76.53,24.7 76.53,34.61 78.18,36.26 78.18,48.62 v72.39,54.41 | v51.51,51.05 15.85,51.05 14.17,49.38 14.17,42.67 10.21,38.71 10.21,34.29 GPS_SD.5
  Bottom 0.152: v72.69,19.2 66.14,19.2 60.96,14.02 GPS__IC_WRITE.2 | MAIN.P$10 v72.39,54.41 63.86,45.87 59.89,45.87 54.71,51.05 v51.51,51.05
N$20  (via drill 0.35)
  Top 0.152: GPS_IC.15 76.66,20.57 76.66,20.12 75.13,18.59 71.63,18.59 68.89,15.85 65.38,15.85 GPS__IC_WRITE.1 53.34,11.43 47.09,5.18 29.41,5.18 29.11,5.49 29.11,6.71 24.54,11.28 23.93,11.28 23.01,12.19 v23.01,28.8
  Bottom 0.152: GPS.3 3.81,39.62 1.98,41.45 1.98,44.81 2.74,45.57 6.25,45.57 16.76,35.05 16.76,33.07 18.75,31.09 20.73,31.09 v23.01,28.8
N$21
  Top 0.152: SOUND__IC_WRITE.5 34.59,26.98 34.59,13.11 30.79,9.3 30.18,9.3 SOUND_IC.23
N$22
  Top 0.152: SOUND_IC.24 30.18,8.69 32,8.69 34.9,11.58 34.9,24.69 39.32,29.11 SOUND__IC_WRITE.6
N$23
  Top 0.152: TWE__IC_WRITE.5 61.11,49.53 62.94,47.7 71.17,47.7 71.32,47.85 71.32,48.62 TWE_IC.23
N$24
  Top 0.152: TWE_IC.24 70.71,48.77 70.71,49.38 68.12,51.97 60.96,51.97 TWE__IC_WRITE.6
N$25
  Top 0.152: 24.23,22.86 25.3,21.79 25.3,17.98 29.41,13.87 30.02,13.87 SOUND_IC.16 | 24.23,22.86 29.11,27.74 29.11,29.11 SOUND__IC_WRITE.2 | 24.23,22.86 U$1.RX
N$26
  Top 0.152: 30.33,30.33 30.33,28.04 30.18,27.89 30.18,14.63 SOUND_IC.15 | 30.33,30.33 29.57,31.09 28.5,31.09 26.67,29.26 SOUND__IC_WRITE.1 | MAIN.P$28 63.55,34.29 62.64,35.2 61.87,35.2 60.96,34.29 60.96,33.83 58.98,31.85 31.85,31.85 30.33,30.33
N$27
  Top 0.152: 58.83,52.12 59.89,53.19 72.08,53.19 75.89,49.38 75.89,48.77 TWE_IC.16 | 58.83,52.12 58.83,44.04 TWE__IC_WRITE.2 | MAIN.P$14 60.96,57.15 60.05,58.06 54.25,58.06 53.65,57.45 53.65,56.84 58.37,52.12 58.83,52.12
N$28  (via drill 0.35)
  Top 0.152: v75.13,46.48 76.66,48.01 76.66,48.62 TWE_IC.15 | CONNECT.2 15.24,48.31 19.81,48.31 22.25,50.75 43.28,50.75 51.82,42.22 51.82,35.36 51.05,34.59 51.05,33.98 51.66,33.38 52.43,33.38 58.37,39.32 60.96,39.32 TWE__IC_WRITE.1
  Bottom 0.152: v75.13,46.48 70.71,46.48 63.7,39.47 60.96,39.47 TWE__IC_WRITE.1
N$29  (via drill 0.35)
  Top 0.152: v31.09,41 28.96,41 27.43,39.47 27.13,39.47 T_LED1.A | v49.38,41 v45.11,41 | v66.29,43.43 67.36,43.43 67.67,43.74 76.35,43.74 76.66,43.43 76.66,42.82 TWE_IC.14
  Bottom 0.152: v45.11,41 v31.09,41 | v49.38,41 51.82,43.43 v66.29,43.43
N$30
  Bottom 0.152: SPEAKER.2 3.81,44.35 11.58,36.58 11.58,28.04 12.34,27.28 13.11,27.28 23.01,17.37 23.01,13.87 24.08,12.8 U$1.SPK1
N$31  (via drill 0.35)
  Top 0.152: v9.14,36.58 9.14,28.04 9.75,27.43 19.36,27.43 20.27,26.52 20.27,24.08 17.78,21.59 17.78,15.24 18.69,14.33 19.36,14.33 22.1,11.58 22.1,9.6 24.08,7.62 U$1.SPK2
  Bottom 0.152: v9.14,36.58 SPEAKER.1
N$32
  Top 0.152: T_LED1.K 28.8,39.32 28.8,36.88 T_R1.2
N$33
  Top 0.152: T_LED2.A 34.75,39.47 35.05,39.47 35.81,40.23 39.78,40.23 47.24,32.77 59.44,32.77 60.66,33.98 60.66,36.42 63.09,38.86 63.09,47.09 61.72,48.46 59.74,48.46 59.13,49.07 59.13,49.99 59.74,50.6 66.14,50.6 67.97,48.77 TWE_IC.28
N$34
  Top 0.152: T_LED2.K 36.42,39.32 36.42,36.88 T_R2.2
N$35
  Top 0.152: SERIAL.5 77.42,60.96 74.52,58.06 65.68,58.06 MAIN.P$13
N$36
  Top 0.152: MAIN.P$20 42.98,57.15 40.23,54.41 16.61,54.41 5.56,43.36 5.56,31.34 2.54,28.32 2.54,18.8 7.32,14.02 19.2,14.02 21.11,12.11 21.11,11.53 21.31,11.33 21.31,5.09 ALT.3
N$37  (via drill 0.35)
  Top 0.152: U$2.P$21 20.32,20.32 v19.05,19.05
  Bottom 0.152: TWE_WRITING.4 11.43,11.43 11.43,17.78 12.7,19.05 v19.05,19.05
N$38  (via drill 0.35)
  Top 0.152: v7.62,6.35 3.81,10.16 v3.81,15.24 | v5.08,20.32 5.08,21.59 6.35,22.86 U$2.P$2
  Bottom 0.152: TWE_WRITING.3 15.24,8.89 12.7,6.35 v7.62,6.35 | v3.81,15.24 3.81,17.78 5.08,19.05 v5.08,20.32
N$39  (via drill 0.35)
  Top 0.152: CONNECT.1 12.65,48.16 12.65,41.6 5.87,34.82 5.87,31.21 3.81,29.16 3.81,17.98 7.32,14.48 13.11,14.48 v13.26,14.63 13.26,14.68 12.7,15.24 U$2.P$8
  Bottom 0.152: v13.26,14.63 17.68,10.21 TWE_WRITING.2
N$40
  Top 0.152: TWE_WRITING.1 18.57,11.91 15,11.91 14.83,11.91 11.2,11.91 U$2.P$9
N$41
  Top 0.152: GPS_IC.4 70.26,14.94 70.26,15.54 73,18.29 76.5,18.29 77.57,19.36 77.57,28.04 78.49,28.96 78.49,49.23 72.7,55.01 72.64,55.01 72.39,55.01 56.85,55.01 54.71,57.15 MAIN.P$17
N$42
  Top 0.152: ER.P$9 74.83,29.26 73.61,29.26 69.49,33.38 63.25,33.38 62.33,34.29 MAIN.P$27
N$43  (via drill 0.35)
  Top 0.152: ER.P$13 64.77,29.11 66.14,29.11 67.06,28.19 75.29,28.19 75.87,28.78 75.87,41.43 v75.89,41.45
  Bottom 0.152: v75.89,41.45 75.89,46.33 86.72,57.15 86.72,60.2 94.64,68.12 94.64,69.19 96.47,71.02 METER.3
N$44
  Bottom 0.152: JOY_E.3 91.44,26.67 87.63,30.48 51.97,30.48 50.75,29.26 49.53,29.26 ER.P$19
N$45  (via drill 0.35)
  Top 0.152: v70.26,31.7 70.1,31.55 50.6,31.55 48.31,29.26 47.09,29.26 ER.P$20
  Bottom 0.152: v70.26,31.7 73.61,31.7 93.98,52.07 94.18,52.27 JOY_R.3
N$46
  Top 0.152: R_TRIM.1 93.98,36.83 91.44,34.29 91.44,28.19 75.89,12.65 67.21,12.65 60.96,6.4 59.74,6.4 ER.P$26
N$47
  Top 0.152: E_TRIM.1 92.96,5.33 56.84,5.33 55.93,6.25 54.71,6.25 ER.P$24
N$48
  Bottom 0.152: ER.P$25 57.15,6.4 58.37,6.4 64.31,12.34 95.25,12.34 95.86,12.95 97.69,12.95 98.27,13.54 98.27,25.72 98.63,26.08 98.63,31.75 98.63,32.18 98.63,37.34 98.27,37.69 98.27,42.7 R_TRIM.4
N$49
  Bottom 0.152: E_TRIM.4 92.66,12.65 59.59,12.65 53.34,6.4 52.12,6.4 ER.P$23
N$50  (via drill 0.35)
  Top 0.152: v29.72,42.37 30.63,42.37 31.7,41.3 31.7,38.25 29.41,35.97 29.26,35.97 22.4,29.11 22.4,10.36 23.77,8.99 24.38,8.99 28.5,4.88 47.24,4.88 48.62,6.25 49.53,6.25 ER.P$22
  Bottom 0.152: v29.72,42.37 29.11,42.98 29.11,68.58 ER_SERVO.1
N$51  (via drill 0.35)
  Top 0.152: v39.32,24.54 39.32,11.12 41.45,8.99 42.06,8.99 44.65,6.4 46.94,6.4 ER.P$21 | v14.78,54.56 15.24,54.56 17.98,57.3 40.69,57.3 41.3,57.91 41.3,64.16 36.88,68.58 ER_SERVO.4
  Bottom 0.152: v39.32,24.54 35.36,28.5 35.36,33.98 v14.78,54.56
NR
  Top 0.152: ER.NR 87.63,32.92 86.72,33.83 86.72,56.24 MAIN.NR
V+
  Top 0.152: 23.32,43.28 C1.1 | 24.08,60.96 MBED.1 | 94.34,34.59 94.37,34.63 94.37,34.66 95.55,35.84 97.69,35.84 98.27,36.42 98.27,37.24 97.69,37.82 95.91,37.82 92.81,40.91 92.81,42.06 | 90.53,58.06 91.44,57.15
  Top 0.2: 94.34,34.59 92.81,33.07 92.81,29.26 ER.VIN | 92.81,42.06 92.81,57.15 MAIN.VIN 91.44,57.15 | 23.32,43.28 23.32,44.35 24.08,45.11 24.08,48.31 LED1.A | GPS.2 3.81,34.59 1.98,36.42 1.98,53.8 10.21,62.03 23.01,62.03 24.08,60.96 | MBED.1 24.23,60.96 30.33,67.06 30.33,67.35 30.3,67.38 30.3,70.94 36.45,77.09 50.8,77.09 51.18,76.71 51.22,76.71 51.82,76.11 51.82,72.39 63.22,60.98 63.22,56.86 64.2,55.88 74.94,55.88 76.56,57.5 76.56,57.52 77.1,58.06 90.53,58.06
  Bottom 0.2: LED1.A 22.86,54.71 22.23,55.34 22.23,59.11 24.08,60.96 MBED.1
VB
  Top 0.152: ER.VB 90.22,29.26 90.22,33.07 91.14,33.98 91.14,56.24 90.22,57.15 MAIN.VB
VCC
  Top 0.152: 38.56,43.28 C3.1
  Top 0.2: 38.56,43.28 38.56,44.35 39.32,45.11 39.32,48.31 LED3.A | SERVO.1 ER_SERVO.2
  Bottom 0.152: 38.1,54.71 37.49,55.32 37.49,59.13 39.32,60.96 SERVO.1
  Bottom 0.2: 38.1,54.71 LED3.A
VDDA  (via drill 0.35)
  Top 0.152: v38.71,9.91 35.97,9.91 SOUND_IC.7 | v71.32,13.56 71.93,14.17 71.93,14.78 GPS_IC.7 | v68.58,34.29 71.93,37.64 71.93,42.67 TWE_IC.7
  Bottom 0.152: v38.71,9.91 40.08,9.91 41.76,11.58 48.62,11.58 | 48.62,11.58 58.06,11.58 59.44,12.95 70.71,12.95 v71.32,13.56 | v68.58,34.29 65.08,30.79 49.84,30.79 48.62,29.57 48.62,11.58
VO
  Top 0.152: MAIN.VOUT 98.62,30.91 98.62,12.97 98.27,12.62 98.27,8.36 96.32,6.4 95.25,6.4 ER.VOUT
VSSA  (via drill 0.35)
  Top 0.152: v40.54,8.99 39.01,10.52 35.97,10.52 SOUND_IC.8 | v55.02,8.99 63.09,8.99 67.06,12.95 71.63,12.95 72.69,14.02 72.69,14.78 GPS_IC.8 72.85,14.94 72.85,15.54 73.15,15.85 74.52,15.85 78.18,19.51 v78.18,22.1 | v73.91,29.87 73.91,34.14 72.85,35.2 72.85,42.67 TWE_IC.8
  Bottom 0.152: v55.02,8.99 v40.54,8.99 | v73.91,29.87 73.91,26.36 v78.18,22.1
VU
  Top 0.152: ER.VU 92.66,6.4 92.66,27.89 91.75,28.8 91.75,33.38 92.66,34.29 MAIN.VU

### Text on the board
tNames: Team Birdman Trial | S-270 Malus